# EAGLE schematic Full Bridge mk2 (no rectification) (EAGLE 8.0.0)
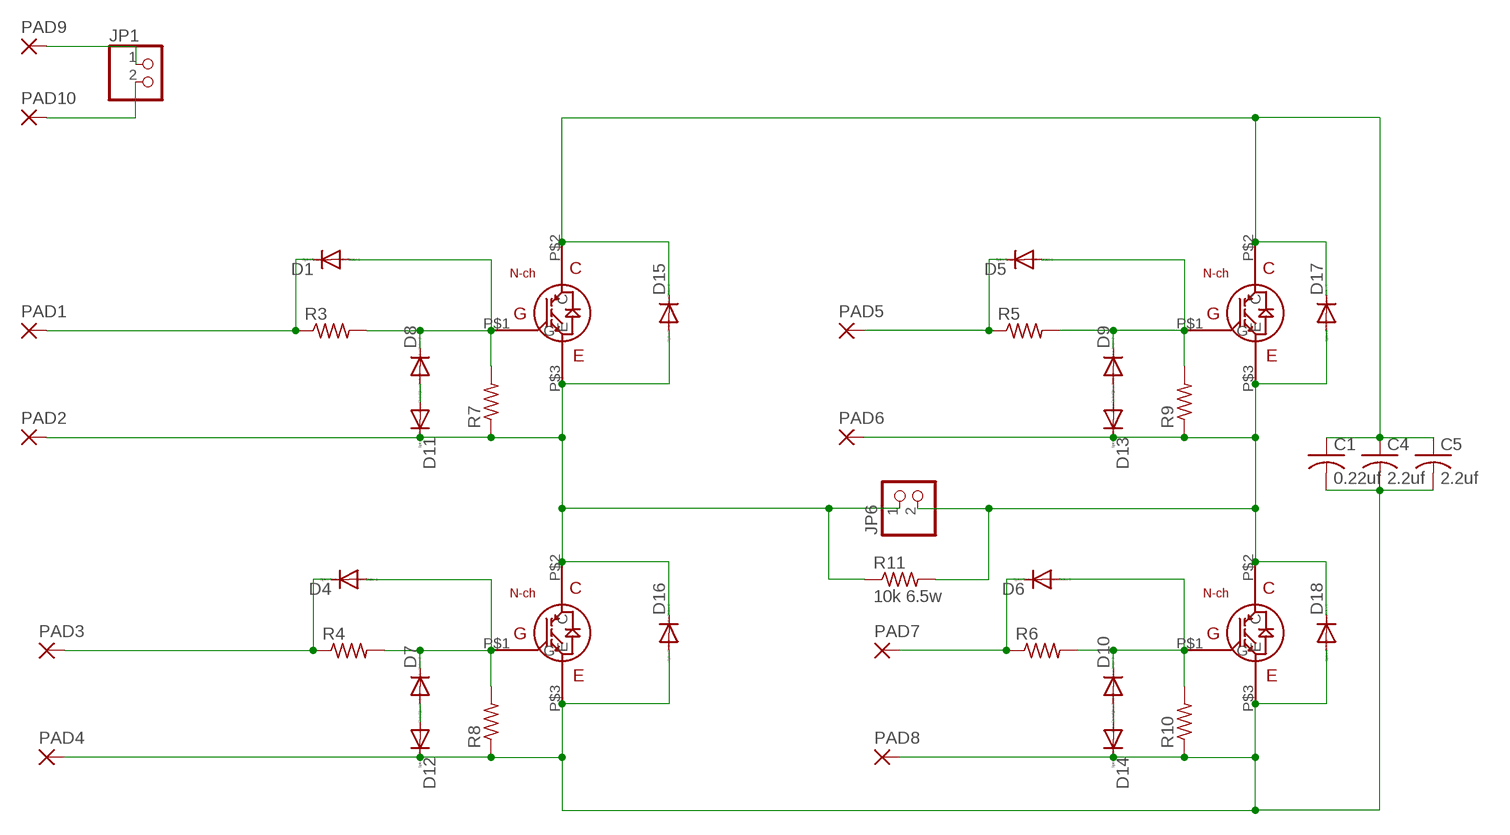
[diagram p0: schematic, sheet 1]

## Parts
C1  0.22uf  C-US375-155X418  [C375-155X418]
C4  2.2uf  C-US275-134X316  [C275-134X316]
C5  2.2uf  C-US275-134X316  [C275-134X316]
D1  DIODE-DO-214AC  [DO-214AC]
D4  DIODE-DO-214AC  [DO-214AC]
D5  DIODE-DO-214AC  [DO-214AC]
D6  DIODE-DO-214AC  [DO-214AC]
D7  DIODE-DO-214AC  [DO-214AC]
D8  DIODE-DO-214AC  [DO-214AC]
D9  DIODE-DO-214AC  [DO-214AC]
D10  DIODE-DO-214AC  [DO-214AC]
D11  DIODE-DO-214AC  [DO-214AC]
D12  DIODE-DO-214AC  [DO-214AC]
D13  DIODE-DO-214AC  [DO-214AC]
D14  DIODE-DO-214AC  [DO-214AC]
D15  DIODE-DO201-15  [DO201-15]
D16  DIODE-DO201-15  [DO201-15]
D17  DIODE-DO201-15  [DO201-15]
D18  DIODE-DO201-15  [DO201-15]
JP1  PINHD-1X2  [1X02]
JP6  PINHD-1X2-9.5  [1X02-9.5]
PAD1  SMD5  [SMD2,54-5,08]
PAD2  SMD5  [SMD2,54-5,08]
PAD3  SMD5  [SMD2,54-5,08]
PAD4  SMD5  [SMD2,54-5,08]
PAD5  SMD5  [SMD2,54-5,08]
PAD6  SMD5  [SMD2,54-5,08]
PAD7  SMD5  [SMD2,54-5,08]
PAD8  SMD5  [SMD2,54-5,08]
PAD9  SMD5  [SMD2,54-5,08]
PAD10  SMD5  [SMD2,54-5,08]
R3  R-US_0207/10  [0207/10]
R4  R-US_0207/10  [0207/10]
R5  R-US_0207/10  [0207/10]
R6  R-US_0207/10  [0207/10]
R7  R-US_R0805  [R0805]
R8  R-US_R0805  [R0805]
R9  R-US_R0805  [R0805]
R10  R-US_R0805  [R0805]
R11  10k 6.5w  R-US_0817/22  [P0817/22]
U$1  TO-247B  [TO-247-FLATFIX]
U$2  TO-247B  [TO-247-FLATFIX]
U$3  TO-247B  [TO-247-FLATFIX]
U$4  TO-247B  [TO-247-FLATFIX]

## Nets
N$1: D1.A D8.C R3.2 R7.2 U$1.P$1(G)
N$2: JP1.1 PAD9.1(P)
N$3: JP1.2 PAD10.1(P)
N$4: D1.C PAD1.1(P) R3.1
N$5: D4.C PAD3.1(P) R4.1
N$6: D4.A D7.C R4.2 R8.2 U$2.P$1(G)
N$7: D5.A D9.C R5.2 R9.2 U$3.P$1(G)
N$8: D5.C PAD5.1(P) R5.1
N$9: D6.A D10.C R6.2 R10.2 U$4.P$1(G)
N$10: D6.C PAD7.1(P) R6.1
N$12 [VCC]: C1.1 C4.1 C5.1 D15.C D17.C U$1.P$2(C) U$3.P$2(C)
N$14: D7.A D12.A
N$16: D8.A D11.A
N$17 [Power1]: D11.C D15.A D16.C JP6.1 PAD2.1(P) R7.1 R11.1 U$1.P$3(E) U$2.P$2(C)
N$19 [Power1]: D13.C D17.A D18.C JP6.2 PAD6.1(P) R9.1 R11.2 U$3.P$3(E) U$4.P$2(C)
N$20 [NEG]: C1.2 C4.2 C5.2 D12.C D14.C D16.A D18.A PAD4.1(P) PAD8.1(P) R8.1 R10.1 U$2.P$3(E) U$4.P$3(E)
N$21: D10.A D14.A
N$22: D9.A D13.A

## Library data of the parts
C1 = resistor:C-US: CAPACITOR, American symbol
C4 C5 = adafruit:C-US: CAPACITOR, American symbol
D1 D4-D18 = diode:DIODE-: DIODE
JP1 = pinhead:PINHD-1X2: PIN HEADER
JP6 = pinhead:PINHD-1X2-9.5: PIN HEADER
PAD1-PAD10 = wirepad:SMD5: SMD PAD
R3-R10 = resistor:R-US_: RESISTOR, American symbol
R11 = adafruit:R-US_: RESISTOR, American symbol
U$1-U$4 = to-247_n-channel_igbt (1):TO-247

## Net classes
1 Power1: width 10.16 mm, clearance 1.27 mm
2 NEG: width 7.62 mm, clearance 1.27 mm
3 VCC: width 7.62 mm